# EAGLE design SCK_URBAN_BOARD_2.3 (EAGLE 9.6.2)
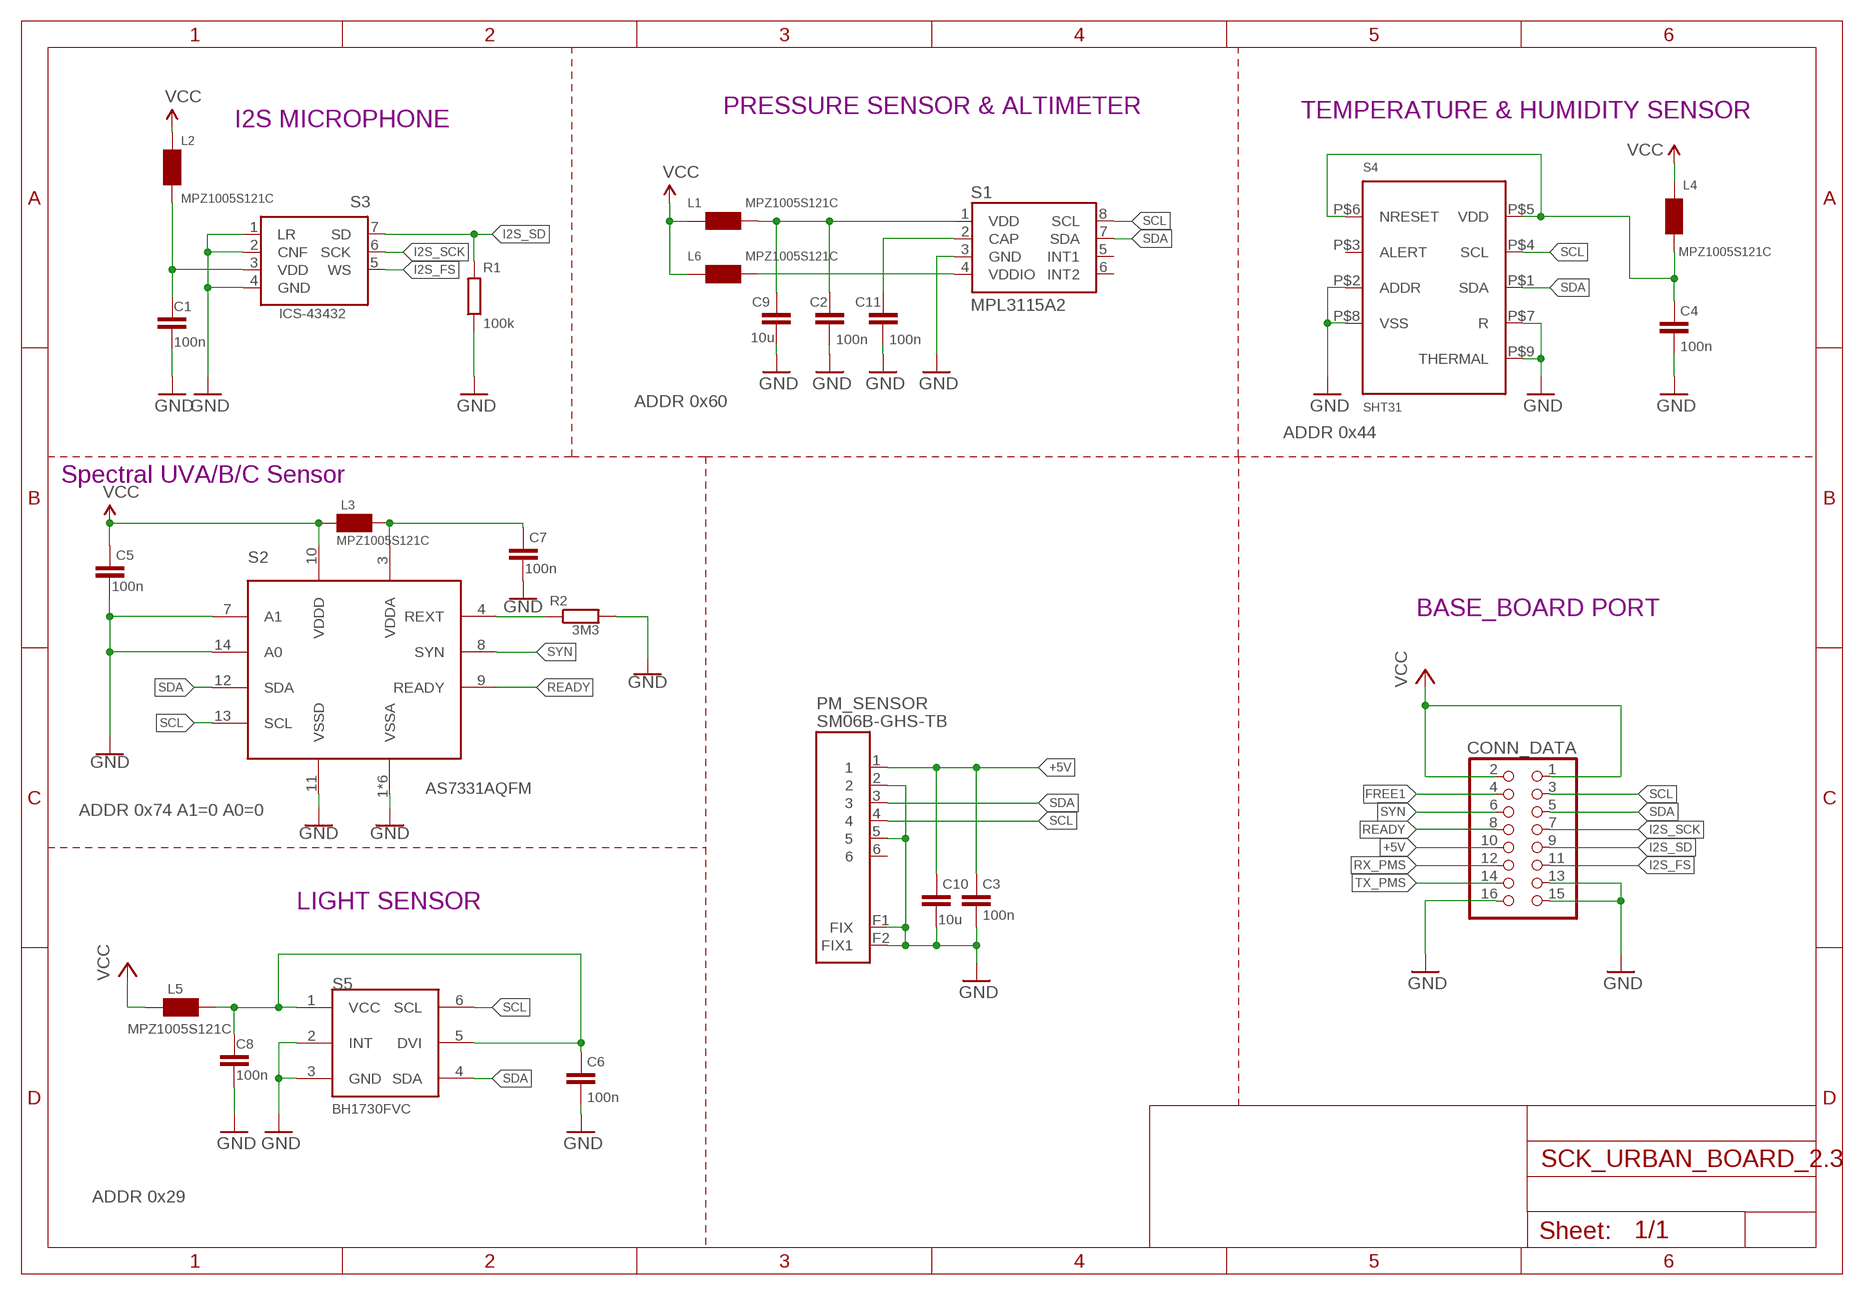
[diagram p0: schematic, sheet 1]

## Parts
C1  100n  C-EUC0402  [C0402]
C2  100n  C-EUC0402  [C0402]
C3  100n  C-EUC0402  [C0402]
C4  100n  C-EUC0402  [C0402]
C5  100n  C-EUC0402  [C0402]
C6  100n  C-EUC0402  [C0402]
C7  100n  C-EUC0402  [C0402]
C8  100n  C-EUC0402  [C0402]
C9  10u  C-EUC0603  [C0603]
C10  10u  C-EUC0603  [C0603]
C11  100n  C-EUC0402  [C0402]
CONN_DATA  PINHD_2X8MAL_SMD  [PINHD_2X8_SMD_MALE_UNHOLED]
L1  MPZ1005S121C  FERRITE-BEAD_0402  [L0402]
L2  MPZ1005S121C  FERRITE-BEAD_0402  [L0402]
L3  MPZ1005S121C  FERRITE-BEAD_0402  [L0402]
L4  MPZ1005S121C  FERRITE-BEAD_0402  [L0402]
L5  MPZ1005S121C  FERRITE-BEAD_0402  [L0402]
L6  MPZ1005S121C  FERRITE-BEAD_0402  [L0402]
PM_SENSOR  SM06B-GHS-TB  [SM06B-GHS-TB]
R1  100k  R-EU_R0402  [R0402]
R2  3M3  R-EU_R0402  [R0402]
S1  MPL3115A2  [MPL3115A2]
S2  AS7331AQFM  [OLGA16]
S3  ICS-43432  [ICS-43432]
S4  SHT31  SHT3X-DIS  [DFN8_STH3X-DIS]
S5  BH1730FVC  [WSOF6]

## Nets
+5V: C3.2 C10.2 CONN_DATA.10 PM_SENSOR.1
FREE1: CONN_DATA.4
GND: C1.1 C2.1 C3.1 C4.1 C5.1 C6.1 C7.1 C8.1 C9.1 C10.1 C11.1 CONN_DATA.13 CONN_DATA.15 CONN_DATA.16 PM_SENSOR.2 PM_SENSOR.5 PM_SENSOR.F1(FIX) PM_SENSOR.F2(FIX1) R1.1 R2.2 S1.3(GND) S2.1(VSSA) S2.2(VSSA) S2.5(VSSA) S2.6(VSSA) S2.7(A1) S2.11(VSSD) S2.14(A0) S2.15(VSSA) S2.16(VSSA) S3.1(LR) S3.2(CNF) S3.4(GND) S4.P$2(ADDR) S4.P$7(R) S4.P$8(VSS) S4.P$9(THERMAL) S5.2(INT) S5.3(GND)
I2S_FS: CONN_DATA.11 S3.5(WS)
I2S_SCK: CONN_DATA.7 S3.6(SCK)
I2S_SD: CONN_DATA.9 R1.2 S3.7(SD)
N$1: C7.2 L3.1 S2.3(VDDA)
N$2: R2.1 S2.4(REXT)
N$3: C6.2 C8.2 L5.2 S5.1(VCC) S5.5(DVI)
N$4: C11.2 S1.2(CAP)
N$5: C4.2 L4.2 S4.P$5(VDD) S4.P$6(NRESET)
N$8: L6.2 S1.4(VDDIO)
N$10: C2.2 C9.2 L1.2 S1.1(VDD)
N$17: C1.2 L2.2 S3.3(VDD)
READY: CONN_DATA.8 S2.9(READY)
RX_PMS: CONN_DATA.12
SCL: CONN_DATA.3 PM_SENSOR.4 S1.8(SCL) S2.13(SCL) S4.P$4(SCL) S5.6(SCL)
SDA: CONN_DATA.5 PM_SENSOR.3 S1.7(SDA) S2.12(SDA) S4.P$1(SDA) S5.4(SDA)
SYN: CONN_DATA.6 S2.8(SYN)
TX_PMS: CONN_DATA.14
VCC: C5.2 CONN_DATA.1 CONN_DATA.2 L1.1 L2.1 L3.2 L4.1 L5.1 L6.1 S2.10(VDDD)
Unconnected: PM_SENSOR.6 S1.5(INT1) S1.6(INT2) S4.P$3(ALERT)

## Notes on the sheet
- PRESSURE SENSOR & ALTIMETER | TEMPERATURE & HUMIDITY SENSOR
- I2S MICROPHONE
- ADDR 0x60
- ADDR 0x44
- Spectral UVA/B/C Sensor
- BASE_BOARD PORT
- ADDR 0x74 A1=0 A0=0
- LIGHT SENSOR
- ADDR 0x29

## Library data of the parts
C1-C11 = Hangar3D:C-EU: CAPACITOR, European symbol
CONN_DATA = Hangar3D:PINHD_2X8
L1-L6 = Hangar3D:FERRITE-BEAD: SMD EMI Suppression Ferrite Beads - excellent anti-EMI properties - low DCR - impedances till 3000 ohms - rated current up to 6 A
PM_SENSOR = Hangar3D:SM06B-GHS-TB
R1 R2 = Hangar3D:R-EU_: RESISTOR, European symbol
S1 = Hangar3D:MPL3115A2
S2 = Hangar3D:AS7331
S3 = Hangar3D:ICS-43432
S4 = Hangar3D:SHT3X-DIS
S5 = Hangar3D:BH1730FVC

## Net classes
1 power: width 1 mm, drill 0.6 mm, clearance 0.203 mm
2 gnd: width 0.254 mm, drill 0.254 mm, clearance 0.178 mm
3 usbvcc: width 0.254 mm, drill 0.6 mm, clearance 0.203 mm
4 aref: width 0.254 mm, drill 0.6 mm, clearance 0.203 mm

## Board
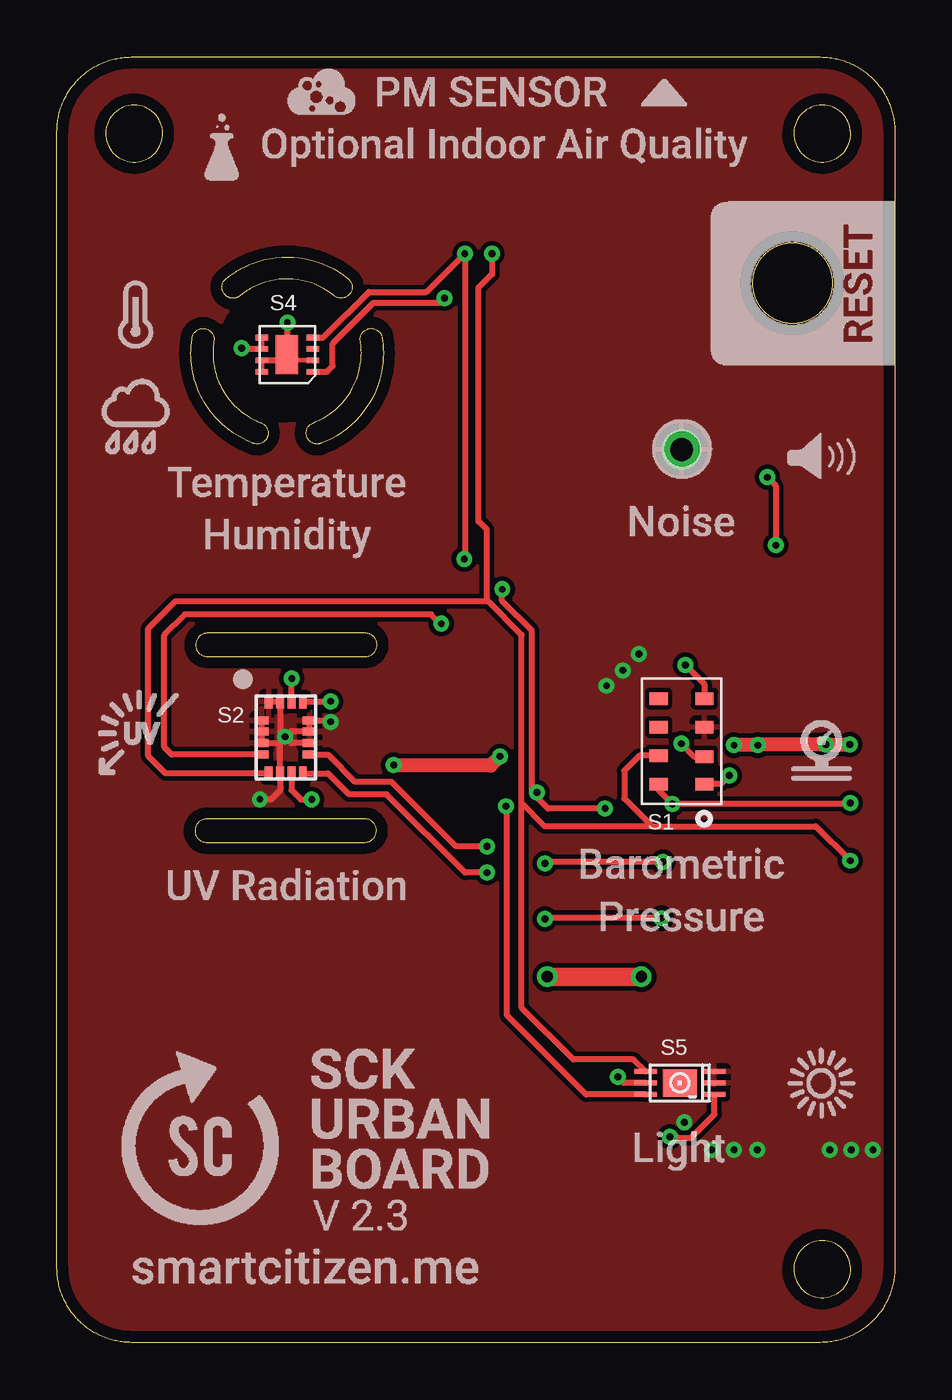
[diagram p1: board, top side]
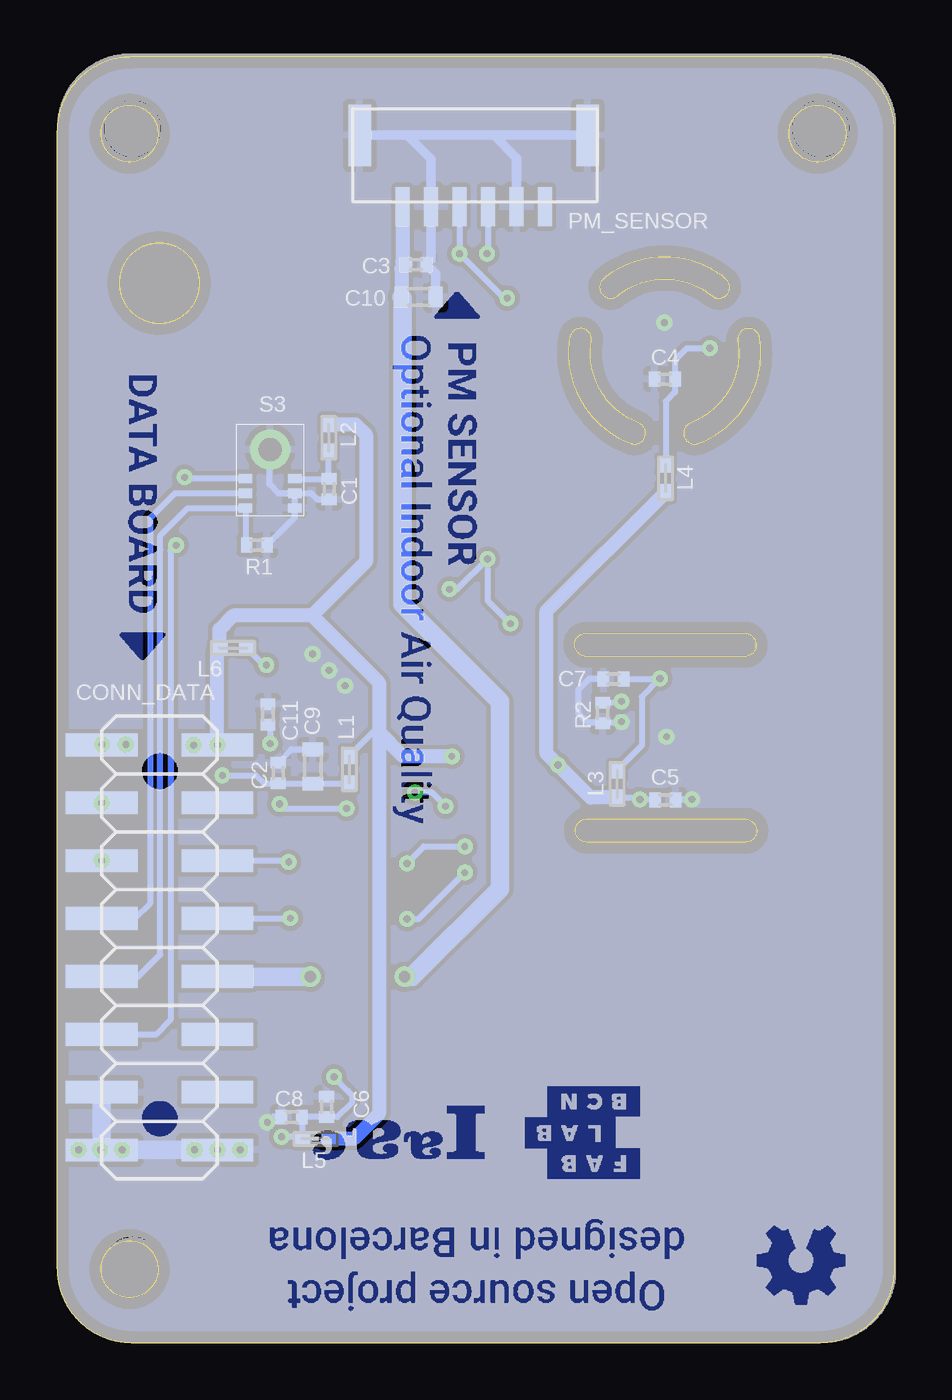
[diagram p2: board, bottom side, seen from below]

Size 36.78 x 56.42 mm. Coordinates in mm from the lower left corner, seen from the top.
Outline: 33.51,0 3.27,0 3.18,0 3.1,0 3.02,0.01 2.94,0.02 2.85,0.03 2.77,0.04 2.69,0.05 2.61,0.07 2.53,0.08 2.45,0.1 2.38,0.12 2.3,0.15 2.22,0.17 2.15,0.2 2.07,0.23 2,0.26 1.93,0.29 1.85,0.32 1.78,0.36 1.71,0.4 1.65,0.43 1.58,0.47 1.51,0.52 1.44,0.56 1.38,0.6 1.32,0.65 1.25,0.7 1.19,0.75 1.13,0.8 1.07,0.85 1.02,0.91 0.96,0.96 0.91,1.02 0.85,1.07 0.8,1.13 0.75,1.19 0.7,1.25 0.65,1.32 0.6,1.38 0.56,1.44 0.52,1.51 0.47,1.58 0.43,1.65 0.4,1.71 0.36,1.78 0.32,1.86 0.29,1.93 0.26,2 0.23,2.07 0.2,2.15 0.17,2.22 0.15,2.3 0.12,2.38 0.1,2.45 0.08,2.53 0.07,2.61 0.05,2.69 0.04,2.77 0.03,2.85 0.02,2.94 0.01,3.02 0,3.1 0,3.19 0,3.27 0,53.15 0,53.23 0,53.32 0.01,53.4 0.02,53.48 0.03,53.57 0.04,53.65 0.05,53.73 0.07,53.81 0.08,53.89 0.1,53.97 0.12,54.04 0.15,54.12 0.17,54.2 0.2,54.27 0.23,54.35 0.26,54.42 0.29,54.49 0.32,54.57 0.36,54.64 0.4,54.71 0.43,54.77 0.47,54.84 0.52,54.91 0.56,54.98 0.6,55.04 0.65,55.1 0.7,55.17 0.75,55.23 0.8,55.29 0.85,55.35 0.91,55.4 0.96,55.46 1.02,55.51 1.07,55.57 1.13,55.62 1.19,55.67 1.25,55.72 1.32,55.77 1.38,55.82 1.44,55.86 1.51,55.9 1.58,55.95 1.65,55.98 1.71,56.02 1.78,56.06 1.85,56.1 1.93,56.13 2,56.16 2.07,56.19 2.15,56.22 2.22,56.25 2.3,56.27 2.38,56.3 2.45,56.32 2.53,56.34 2.61,56.35 2.69,56.37 2.77,56.38 2.85,56.39 2.94,56.4 3.02,56.41 3.1,56.42 3.18,56.42 3.27,56.42 33.51,56.42 33.59,56.42 33.68,56.42 33.76,56.41 33.84,56.4 33.92,56.39 34.01,56.38 34.09,56.37 34.17,56.35 34.25,56.34 34.32,56.32 34.4,56.3 34.48,56.27 34.55,56.25 34.63,56.22 34.7,56.19 34.78,56.16 34.85,56.13 34.92,56.1 34.99,56.06 35.06,56.02 35.13,55.98 35.2,55.95 35.27,55.9 35.33,55.86 35.4,55.82 35.46,55.77 35.52,55.72 35.59,55.67 35.65,55.62 35.7,55.57 35.76,55.51 35.82,55.46 35.87,55.4 35.93,55.35 35.98,55.29 36.03,55.23 36.08,55.17 36.13,55.1 36.17,55.04 36.22,54.98 36.26,54.91 36.3,54.84 36.34,54.77 36.38,54.71 36.42,54.64 36.45,54.57 36.49,54.49 36.52,54.42 36.55,54.35 36.58,54.27 36.61,54.2 36.63,54.12 36.65,54.04 36.67,53.97 36.69,53.89 36.71,53.81 36.73,53.73 36.74,53.65 36.75,53.57 36.76,53.48 36.77,53.4 36.77,53.32 36.78,53.23 36.78,53.15 36.78,3.27 36.78,3.19 36.77,3.1 36.77,3.02 36.76,2.94 36.75,2.85 36.74,2.77 36.73,2.69 36.71,2.61 36.69,2.53 36.67,2.45 36.65,2.38 36.63,2.3 36.61,2.22 36.58,2.15 36.55,2.07 36.52,2 36.49,1.93 36.45,1.86 36.42,1.78 36.38,1.71 36.34,1.65 36.3,1.58 36.26,1.51 36.22,1.44 36.17,1.38 36.13,1.32 36.08,1.25 36.03,1.19 35.98,1.13 35.93,1.07 35.87,1.02 35.82,0.96 35.76,0.91 35.7,0.85 35.65,0.8 35.59,0.75 35.52,0.7 35.46,0.65 35.4,0.6 35.33,0.56 35.27,0.52 35.2,0.47 35.13,0.43 35.06,0.4 34.99,0.36 34.92,0.32 34.85,0.29 34.78,0.26 34.7,0.23 34.63,0.2 34.55,0.17 34.48,0.15 34.4,0.12 34.32,0.1 34.25,0.08 34.17,0.07 34.09,0.05 34.01,0.04 33.92,0.03 33.84,0.02 33.76,0.01 33.68,0 33.59,0 33.51,0
Outline: 11.42,39.43 11.39,39.43 11.36,39.44 11.32,39.44 11.29,39.45 11.26,39.46 11.23,39.47 11.2,39.49 11.17,39.51 11.14,39.52 11.12,39.54 11.09,39.57 11.07,39.59 11.04,39.62 11.02,39.64 11.01,39.67 10.99,39.71 10.98,39.74 10.96,39.78 10.95,39.82 10.94,39.87 10.94,39.91 10.94,39.95 10.95,40 10.96,40.04 10.97,40.08 10.99,40.12 11.01,40.16 11.03,40.2 11.06,40.23 11.09,40.26 11.12,40.29 11.15,40.32 11.19,40.34 11.23,40.36 11.36,40.41 11.55,40.5 11.73,40.6 11.91,40.7 12.07,40.82 12.23,40.95 12.38,41.09 12.52,41.23 12.65,41.39 12.77,41.55 12.88,41.72 12.98,41.9 13.07,42.08 13.15,42.27 13.22,42.46 13.27,42.66 13.31,42.87 13.34,43.02 13.34,43.08 13.35,43.13 13.35,43.19 13.36,43.24 13.36,43.3 13.36,43.35 13.36,43.41 13.36,43.46 13.36,43.52 13.36,43.57 13.35,43.63 13.35,43.68 13.35,43.74 13.34,43.79 13.33,43.84 13.33,43.9 13.32,43.95 13.31,44 13.31,44.04 13.32,44.09 13.32,44.13 13.33,44.17 13.35,44.21 13.37,44.25 13.39,44.29 13.42,44.33 13.44,44.36 13.47,44.39 13.51,44.41 13.54,44.44 13.58,44.46 13.62,44.48 13.67,44.49 13.71,44.5 13.76,44.51 13.8,44.51 13.84,44.51 13.89,44.5 13.93,44.49 13.97,44.48 14.01,44.46 14.05,44.44 14.08,44.41 14.12,44.39 14.15,44.36 14.18,44.32 14.2,44.29 14.22,44.25 14.24,44.21 14.26,44.16 14.27,44.12 14.28,44.06 14.29,43.99 14.3,43.92 14.31,43.85 14.31,43.77 14.32,43.7 14.32,43.63 14.32,43.56 14.33,43.49 14.33,43.42 14.33,43.35 14.32,43.28 14.32,43.21 14.32,43.14 14.31,43.06 14.31,42.99 14.3,42.92 14.28,42.76 14.23,42.5 14.16,42.24 14.08,41.98 13.98,41.74 13.87,41.5 13.74,41.27 13.6,41.05 13.45,40.83 13.28,40.63 13.1,40.44 12.91,40.26 12.71,40.09 12.49,39.93 12.27,39.79 12.03,39.66 11.79,39.54 11.59,39.46 11.58,39.46 11.57,39.46 11.56,39.45 11.55,39.45 11.54,39.45 11.53,39.45 11.52,39.44 11.51,39.44 11.5,39.44 11.49,39.44 11.48,39.44 11.47,39.44 11.46,39.43 11.45,39.43 11.44,39.43 11.43,39.43 11.42,39.43
Outline: 8.79,39.43 8.74,39.43 8.69,39.44 8.64,39.45 8.62,39.46 8.61,39.47 8.59,39.47 8.55,39.49 8.47,39.52 8.32,39.59 8.16,39.67 8.01,39.75 7.86,39.84 7.72,39.93 7.58,40.03 7.56,40.05 7.55,40.05 7.55,40.06 7.53,40.07 7.4,40.17 7.28,40.28 7.16,40.39 7.05,40.5 6.94,40.62 6.83,40.75 6.73,40.87 6.64,41 6.55,41.13 6.47,41.27 6.39,41.41 6.32,41.55 6.25,41.69 6.19,41.84 6.13,41.99 6.08,42.14 6.03,42.29 5.99,42.44 5.96,42.6 5.93,42.76 5.91,42.91 5.89,43.07 5.88,43.23 5.88,43.4 5.88,43.56 5.89,43.72 5.9,43.88 5.92,44.05 5.93,44.09 5.93,44.1 5.93,44.1 5.93,44.1 5.93,44.11 5.94,44.12 5.95,44.17 5.97,44.22 6,44.27 6.03,44.31 6.06,44.35 6.1,44.39 6.14,44.42 6.19,44.45 6.23,44.47 6.28,44.49 6.33,44.5 6.39,44.51 6.44,44.51 6.49,44.5 6.55,44.49 6.6,44.47 6.65,44.45 6.69,44.42 6.73,44.38 6.77,44.35 6.8,44.31 6.83,44.26 6.85,44.22 6.87,44.17 6.88,44.12 6.89,44.06 6.89,44.01 6.89,43.95 6.89,43.95 6.89,43.95 6.89,43.94 6.88,43.91 6.87,43.85 6.86,43.72 6.85,43.6 6.84,43.47 6.85,43.35 6.85,43.22 6.86,43.1 6.88,42.98 6.89,42.85 6.92,42.73 6.95,42.61 6.98,42.5 7.02,42.38 7.06,42.26 7.1,42.15 7.15,42.04 7.21,41.93 7.26,41.82 7.33,41.71 7.39,41.61 7.46,41.51 7.54,41.41 7.62,41.31 7.7,41.22 7.79,41.13 7.88,41.04 7.97,40.96 8.07,40.88 8.12,40.84 8.13,40.83 8.13,40.82 8.13,40.82 8.14,40.82 8.17,40.8 8.28,40.72 8.39,40.65 8.5,40.58 8.62,40.52 8.74,40.46 8.86,40.41 8.92,40.38 8.95,40.37 8.98,40.36 9.03,40.33 9.07,40.3 9.11,40.27 9.15,40.23 9.18,40.19 9.21,40.15 9.23,40.1 9.25,40.05 9.26,40 9.27,39.95 9.27,39.89 9.26,39.84 9.25,39.79 9.24,39.76 9.24,39.74 9.22,39.7 9.2,39.66 9.17,39.63 9.15,39.59 9.12,39.56 9.09,39.54 9.05,39.51 9.02,39.49 8.98,39.47 8.95,39.46 8.91,39.45 8.87,39.44 8.83,39.43 8.79,39.43
Outline: 7.73,45.83 7.71,45.83 7.68,45.83 7.66,45.84 7.63,45.84 7.61,45.84 7.59,45.85 7.56,45.86 7.54,45.87 7.52,45.88 7.5,45.89 7.47,45.9 7.45,45.92 7.43,45.93 7.41,45.95 7.39,45.96 7.38,45.98 7.36,46 7.33,46.04 7.31,46.07 7.29,46.11 7.27,46.15 7.26,46.2 7.25,46.24 7.25,46.28 7.25,46.32 7.25,46.37 7.26,46.41 7.27,46.45 7.28,46.49 7.3,46.53 7.32,46.57 7.35,46.61 7.38,46.64 7.41,46.67 7.45,46.71 7.51,46.76 7.56,46.8 7.62,46.84 7.68,46.88 7.74,46.92 7.8,46.96 7.86,47 7.92,47.04 7.98,47.07 8.04,47.11 8.1,47.14 8.17,47.17 8.23,47.21 8.3,47.24 8.36,47.27 8.43,47.3 8.56,47.35 8.81,47.44 9.07,47.51 9.33,47.57 9.59,47.61 9.85,47.64 10.12,47.64 10.38,47.64 10.64,47.61 10.9,47.57 11.15,47.51 11.41,47.44 11.66,47.35 11.9,47.24 12.13,47.12 12.37,46.99 12.59,46.84 12.78,46.69 12.82,46.66 12.85,46.62 12.87,46.59 12.9,46.55 12.92,46.51 12.93,46.47 12.94,46.43 12.95,46.39 12.96,46.34 12.96,46.3 12.95,46.26 12.95,46.21 12.94,46.17 12.92,46.13 12.9,46.09 12.88,46.05 12.85,46.01 12.82,45.98 12.79,45.95 12.75,45.92 12.72,45.9 12.68,45.88 12.64,45.86 12.6,45.85 12.55,45.84 12.51,45.83 12.47,45.83 12.42,45.84 12.38,45.84 12.34,45.85 12.3,45.87 12.26,45.88 12.22,45.91 12.18,45.93 12.06,46.03 11.89,46.15 11.71,46.25 11.53,46.35 11.34,46.43 11.15,46.51 10.96,46.56 10.76,46.61 10.56,46.65 10.36,46.67 10.16,46.68 9.96,46.68 9.75,46.66 9.55,46.63 9.35,46.59 9.15,46.54 8.95,46.47 8.82,46.41 8.77,46.39 8.72,46.37 8.67,46.34 8.62,46.32 8.57,46.3 8.52,46.27 8.48,46.24 8.43,46.21 8.38,46.19 8.34,46.16 8.29,46.13 8.24,46.1 8.2,46.06 8.16,46.03 8.11,46 8.07,45.97 8.03,45.94 8.02,45.92 8,45.91 7.98,45.9 7.97,45.89 7.95,45.88 7.93,45.87 7.92,45.87 7.9,45.86 7.88,45.85 7.86,45.85 7.84,45.84 7.82,45.84 7.8,45.84 7.79,45.83 7.77,45.83 7.75,45.83 7.73,45.83
Outline: 3.39,54.3 3.26,54.3 3.14,54.28 3.02,54.25 2.91,54.21 2.8,54.16 2.7,54.1 2.6,54.03 2.52,53.95 2.44,53.86 2.36,53.77 2.3,53.67 2.25,53.56 2.2,53.45 2.17,53.33 2.15,53.21 2.14,53.09 2.14,52.96 2.16,52.84 2.19,52.72 2.22,52.6 2.27,52.49 2.33,52.39 2.4,52.29 2.48,52.2 2.56,52.12 2.65,52.05 2.75,51.98 2.86,51.93 2.97,51.88 3.08,51.84 3.2,51.82 3.33,51.81 3.45,51.81 3.58,51.82 3.7,51.84 3.81,51.88 3.92,51.93 4.03,51.98 4.13,52.05 4.22,52.12 4.3,52.2 4.38,52.29 4.45,52.39 4.51,52.49 4.56,52.6 4.59,52.72 4.62,52.84 4.64,52.96 4.64,53.09 4.63,53.21 4.61,53.33 4.58,53.45 4.53,53.56 4.48,53.67 4.42,53.77 4.34,53.86 4.26,53.95 4.17,54.03 4.08,54.1 3.98,54.16 3.87,54.21 3.76,54.25 3.64,54.28 3.52,54.3 3.39,54.3
Outline: 33.59,54.3 33.47,54.3 33.34,54.28 33.23,54.25 33.11,54.21 33,54.16 32.9,54.1 32.81,54.03 32.72,53.95 32.64,53.86 32.57,53.77 32.5,53.67 32.45,53.56 32.41,53.45 32.37,53.33 32.35,53.21 32.34,53.09 32.34,52.96 32.36,52.84 32.39,52.72 32.43,52.6 32.47,52.49 32.53,52.39 32.6,52.29 32.68,52.2 32.76,52.12 32.85,52.05 32.95,51.98 33.06,51.93 33.17,51.88 33.28,51.84 33.4,51.82 33.53,51.81 33.65,51.81 33.78,51.82 33.9,51.84 34.01,51.88 34.12,51.93 34.23,51.98 34.33,52.05 34.42,52.12 34.51,52.2 34.58,52.29 34.65,52.39 34.71,52.49 34.76,52.6 34.8,52.72 34.82,52.84 34.84,52.96 34.84,53.09 34.83,53.21 34.81,53.33 34.78,53.45 34.73,53.56 34.68,53.67 34.62,53.77 34.55,53.86 34.46,53.95 34.38,54.03 34.28,54.1 34.18,54.16 34.07,54.21 33.96,54.25 33.84,54.28 33.72,54.3 33.59,54.3
Outline: 33.59,4.47 33.47,4.46 33.34,4.45 33.23,4.42 33.11,4.38 33,4.32 32.9,4.26 32.81,4.19 32.72,4.11 32.64,4.03 32.57,3.93 32.5,3.83 32.45,3.73 32.41,3.62 32.37,3.5 32.35,3.38 32.34,3.25 32.34,3.13 32.36,3 32.39,2.88 32.43,2.77 32.47,2.66 32.53,2.56 32.6,2.46 32.68,2.37 32.76,2.29 32.85,2.21 32.95,2.15 33.06,2.09 33.17,2.04 33.28,2.01 33.4,1.98 33.53,1.97 33.65,1.97 33.78,1.98 33.9,2.01 34.01,2.04 34.12,2.09 34.23,2.15 34.33,2.21 34.42,2.29 34.51,2.37 34.58,2.46 34.65,2.56 34.71,2.66 34.76,2.77 34.8,2.88 34.82,3 34.84,3.13 34.84,3.25 34.83,3.38 34.81,3.5 34.78,3.62 34.73,3.73 34.68,3.83 34.62,3.93 34.55,4.03 34.46,4.11 34.38,4.19 34.28,4.26 34.18,4.32 34.07,4.38 33.96,4.42 33.84,4.45 33.72,4.46 33.59,4.47
Outline: 6.6,31.13 arc90 6.09,30.62 6.09,30.59 arc90 6.57,30.11 13.51,30.11 arc90 14.05,30.59 arc90 13.57,31.13 6.6,31.13
Outline: 6.57,22.97 arc90 6.06,22.47 6.06,22.44 arc90 6.54,21.96 13.49,21.96 arc90 14.02,22.44 arc90 13.54,22.97 6.57,22.97
Outline: circle at 32.28,46.49 radius 1.75
Copper layers (1*16): Top 0.035mm / dielectric 1.5mm / Bottom 0.035mm
Design rules "default *": minimum track width 0.2mm, minimum drill 0.3mm, track to track 0.2mm, track to pad 0.2mm, pad to pad 0.2mm, via to via 0.2mm, smd to smd 0.2mm, copper to edge 20mil, drill to drill 0.6mm, minimum pad ring 10mil, minimum via ring 0.2mm, stop-mask expansion 2mil, vias tented up to drill 24mil, thermal gap 10mil
tRestrict: area 7.1,40.5 to 13.1,46.5

### Footprints (pad centres in the part's own frame; a part is rotated, then mirrored left to right if it is on the bottom)
C0402 = smd 0.5 x 0.65: 1 -0.45,0; 2 0.45,0
C0603 = smd 0.6 x 0.9: 1 -0.8,0; 2 0.7,0
PINHD_2X8_SMD_MALE_UNHOLED = smd 1 x 3.15: 1 -8.89,-2.54; 2 -8.89,2.54; 3 -6.35,-2.54; 4 -6.35,2.54; 5 -3.81,-2.54; 6 -3.81,2.54; 7 -1.27,-2.54; 8 -1.27,2.54; 9 1.27,-2.54; 10 1.27,2.54; 11 3.81,-2.54; 12 3.81,2.54; 13 6.35,-2.54; 14 6.35,2.54; 15 8.89,-2.54; 16 8.89,2.54
L0402 = smd 0.7 x 0.6: 1 -0.6,0; 2 0.6,0
SM06B-GHS-TB = smd 0.6 x 1.7: 1 -3.125,0; 2 -1.875,0; 3 -0.625,0; 4 0.625,0; 5 1.875,0; 6 3.125,0 | smd 1 x 2.7: F1 -5,3.125; F2 5,3.125
R0402 = smd 0.5 x 0.65: 1 -0.45,0; 2 0.45,0
MPL3115A2 = smd 0.55 x 0.8: 1 -1.875,-1; 2 -0.675,-1; 3 0.625,-1; 4 1.875,-1; 5 1.875,1; 6 0.625,1; 7 -0.625,1; 8 -1.875,1
OLGA16 = smd 0.35 x 0.6: 1 -0.75,1.575; 2 -0.25,1.575; 3 0.25,1.575; 4 0.75,1.575; 9 0.75,-1.575; 10 0.25,-1.575; 11 -0.25,-1.575; 12 -0.75,-1.575 | smd 0.6 x 0.35: 5 1.05,0.75; 6 1.05,0.25; 7 1.05,-0.25; 8 1.05,-0.75; 13 -1.05,-0.75; 14 -1.05,-0.25; 15 -1.05,0.25; 16 -1.05,0.75
ICS-43432 = smd 0.4 x 0.6: 1 2.572,1.079; 2 1.924,1.079; 3 1.276,1.079; 5 1.276,-1.079; 6 1.924,-1.079; 7 2.572,-1.079 | drill 1 pad 1.75: 4 0,0
DFN8_STH3X-DIS = smd 0.55 x 0.25: P$1 -1.149,0.737; P$2 -1.149,0.237; P$3 -1.149,-0.263; P$4 -1.149,-0.763; P$5 1.101,-0.763; P$6 1.101,-0.263; P$7 1.101,0.237; P$8 1.101,0.737 | smd 1 x 1.7: P$9 0.001,-0.013
WSOF6 = smd 0.22 x 1: 1 -0.5,-1.5; 2 0,-1.5; 3 0.5,-1.5; 4 0.5,1.5; 5 0,1.5; 6 -0.5,1.5 | smd 1.2 x 1.5: P$1 0,0

### Placement (x,y rotation side)
C1  24.84,37.45 90 bottom
C2  27.08,24.99 270 bottom
C3  21.02,47.31 180 bottom
C4  10.1,42.28 0 bottom
C5  10.08,23.81 180 bottom
C6  24.95,10.35 270 bottom
C7  12.35,29.13 0 bottom
C8  26.48,9.9 0 bottom
C9  25.55,25.23 270 bottom
C10  20.96,45.89 180 bottom
C11  27.52,27.57 270 bottom
CONN_DATA  32.28,17.34 270 bottom
L1  23.95,25.15 270 bottom
L2  24.86,39.71 270 bottom
L3  12.19,24.51 270 bottom
L4  10.06,37.93 90 bottom
L5  25.42,8.94 180 bottom
L6  29.04,30.48 0 bottom
PM_SENSOR  18.49,49.85 0 bottom
R1  28,35 180 bottom
R2  12.82,27.63 270 bottom
S1  27.42,26.38 90 top
S2  10.04,26.56 0 top
S3  27.42,39.19 270 bottom
S4  10.09,43.34 180 top
S5  27.34,11.39 90 top

### Tracks (layer width: path | path; a pad name or v marks a point on that pad's centre or on a via)
+5V  (via drill 0.5 pad 0.7)
  Top 0.813: v21.52,16.05 v25.65,16.05
  Bottom 0.254: 21.12,16.13 21.2,16.05 | 29.72,16.05 CONN_DATA.10
  Bottom 0.61: PM_SENSOR.1 21.61,47.45 C3.2 21.66,47.12 C10.2
  Bottom 0.813: 21.12,16.13 17.33,19.91 17.33,28.14 21.6,32.41 21.6,45.83 C10.2 | 21.2,16.05 v21.52,16.05 | v25.65,16.05 29.72,16.05
GND  (via drill 0.3, 0.3 pad 0.7)
  Top 0.2: S4.P$2 10.34,43.11 S4.P$9
  Top 0.254: S4.P$9 10.09,43.22 9.98,43.11 S4.P$7 S4.P$8 | S4.P$9 10.34,43.11 | v10.12,44.77 10.09,44.74 S4.P$9 | 10.12,26.59 v10.02,26.59 | S2.7 10.29,26.31 v10.02,26.59 | v10.02,26.59 10.24,26.81 S2.6 S2.5 11.94,27.31 v12.01,27.24 | S2.16 S2.15 | S2.15 S2.14 9.74,26.31 v10.02,26.59 | v10.02,26.59 9.79,26.36 S2.11 9.79,24.23 9.41,23.84 v8.91,23.84 | S2.1 S2.2 9.79,26.81 v10.02,26.59 | S2.14 S2.15
  Bottom 0.254: S3.2 25.61,37.27 25.34,37 C1.1 | S3.2 S3.1 26.34,36.21 R1.1 | S3.2 26.36,37.29 | C8.1 27.31,9.89 v27.54,9.66 | v8.91,23.84 9.6,23.84 C5.1 | C7.1 13.42,29.12 13.91,28.64 13.91,27.64 13.51,27.24 12.88,27.24 R2.2 12.77,27.24 v12.01,27.24 | S3.2 27.05,37.27 27.45,37.67 27.45,39.16 S3.4 | C2.1 26.49,26.03 C9.1
  Bottom 0.406: PM_SENSOR.F2 17.6,52.98 | 17.6,52.98 21.4,52.98 | 21.4,52.98 PM_SENSOR.F1 | 21.4,52.98 20.36,51.94 PM_SENSOR.2 20.36,47.52 C3.1 20.16,46.9 C10.1 | PM_SENSOR.5 16.61,51.99 17.6,52.98
  Bottom 0.813: CONN_DATA.13 CONN_DATA.15 CONN_DATA.16
  other vias: 28.74,8.46 29.72,8.46 30.74,8.46 33.92,8.46 34.87,8.46 35.82,8.46 24.13,28.82 24.84,29.5 25.55,30.21
  pour Bottom (rank 2): 37.28,57.44 -0.72,57.79 -0.45,-0.89 37.33,-1.06
  pour Top (rank 2): 37.28,57.44 -0.72,57.54 -0.82,-0.91 37.28,-0.86
I2S_FS  (via drill 0.3 pad 0.7)
  Top 0.254: v31.18,37.97 31.55,37.6 v31.55,34.99
  Bottom 0.254: CONN_DATA.11 32.41,13.53 31.79,14.15 31.79,34.75 v31.55,34.99 | S3.5 31.12,37.92 v31.18,37.97
I2S_SCK
  Bottom 0.254: CONN_DATA.7 33.36,18.61 32.7,19.27 32.7,36.18 31.61,37.27 S3.6
I2S_SD
  Bottom 0.254: R1.2 28.5,35.05 S3.7 31.04,36.62 32.24,35.42 32.24,34.8 32.24,17.03 33.21,16.07 CONN_DATA.9
N$1  (via drill 0.3)
  Top 0.254: S2.3 v10.29,29.13 v10.31,29.14
  Bottom 0.254: C7.2 10.32,29.12 v10.31,29.14 11.11,28.34 11.11,26.2 L3.1
N$2  (via drill 0.3)
  Top 0.254: S2.4 v12.01,28.14
  Bottom 0.254: R2.1 12.06,28.08 v12.01,28.14
N$3  (via drill 0.3 pad 0.7)
  Top 0.254: S5.5 24.89,11.39 v24.62,11.66 | S5.1 28.86,10.87 28.86,10.02 27.82,8.98 27.26,8.98 27.23,9.02 v26.91,9.02
  Bottom 0.254: v24.62,11.66 24.01,11.05 23.82,10.86 23.82,10.55 24.47,9.9 C6.2 C8.2 L5.2 26.1,9.02 v26.91,9.02
N$4  (via drill 0.3 pad 0.7)
  Top 0.254: v27.42,26.28 27.99,25.71 S1.2
  Bottom 0.254: C11.2 27.42,27.02 v27.42,26.28
N$5  (via drill 0.3 pad 0.7)
  Top 0.254: S4.P$5 S4.P$6 8.14,43.61 v8.11,43.64
  Bottom 0.254: v8.11,43.64 9.13,43.64 9.65,43.12 C4.2 9.65,41.7 10.06,41.3 L4.2
N$8  (via drill 0.3 pad 0.7)
  Top 0.254: v27.58,29.74 28.42,28.91 S1.4
  Bottom 0.254: L6.2 27.7,29.74 v27.58,29.74
N$10  (via drill 0.3 pad 0.7)
  Top 0.254: v29.52,24.89 29.13,24.51 S1.1
  Bottom 0.254: v29.52,24.89 28.06,24.89 27.69,24.53 27.09,24.53 C2.2 25.56,24.54 C9.2 23.97,24.53 L1.2
N$17
  Bottom 0.254: S3.3 26.32,37.9 C1.2 24.86,37.92 L2.2
READY  (via drill 0.3 pad 0.7)
  Top 0.254: S2.9 11.89,24.98 12.81,24.06 14.47,24.06 17.91,20.62 v18.88,20.62 | v26.54,18.62 21.45,18.62 v21.42,18.59
  Bottom 0.254: CONN_DATA.8 26.55,18.61 v26.54,18.62 | v21.42,18.59 20.91,18.59 v18.88,20.62
SCL  (via drill 0.3, 0.3 pad 0.7)
  Top 0.254: S2.13 5.04,25.81 4.71,26.14 4.71,31.04 5.62,31.96 16.42,31.96 16.83,31.55 v16.87,31.55 | v17.88,34.39 17.9,34.41 v17.9,47.79 16.22,46.11 13.69,46.11 11.69,44.11 S4.P$4 | S1.8 26.42,24.23 v27.01,23.64 34.77,23.64 CONN_DATA.3 | v24.06,23.44 21.55,23.44 20.85,24.14 20.85,24.36 | 20.85,24.36 20.85,31.25 19.54,32.55 v19.54,33.06 | S5.6 23.22,10.89 19.76,14.36 19.76,23.5 v19.72,23.54 | v21.07,24.14 20.85,24.36
  Bottom 0.254: v17.9,47.79 17.86,47.83 PM_SENSOR.4 | v16.87,31.55 17.88,32.56 v17.88,34.39 19.21,33.06 v19.54,33.06 | v27.01,23.64 26.81,23.44 v24.06,23.44 | v19.72,23.54 20.32,24.14 v21.07,24.14
  other vias: 34.82,23.69
SDA  (via drill 0.3, 0.3 pad 0.7)
  Top 0.254: S2.12 4.77,24.98 4.01,25.74 4.01,31.34 5.21,32.54 18.87,32.54 | v19.1,47.79 19.1,46.89 18.5,46.29 18.5,36.04 18.87,35.68 18.87,32.54 | 20.39,23.67 20.39,14.69 22.66,12.42 25.31,12.42 S5.4 | 20.39,23.67 20.39,31.06 18.89,32.56 18.87,32.54 | S4.P$1 11.85,42.61 12.1,42.85 12.1,43.84 13.9,45.63 16.81,45.63 v17.01,45.84 | v17.01,45.84 | S1.7 25.57,25.76 24.91,25.1 24.91,23.88 26.13,22.66 | CONN_DATA.5 33.31,22.66 26.13,22.66 | 26.13,22.66 21.41,22.66 20.39,23.67
  Bottom 0.254: PM_SENSOR.3 v19.11,47.8 v19.1,47.79 17.15,45.84 v17.01,45.84
  other vias: 34.82,21.15
SYN  (via drill 0.3 pad 0.7)
  Top 0.254: S2.8 11.89,25.81 13.09,24.61 14.69,24.61 17.52,21.78 v18.88,21.78 | v26.6,21.1 21.49,21.1 v21.42,21.03
  Bottom 0.254: CONN_DATA.6 26.65,21.15 v26.6,21.1 | v21.42,21.03 20.67,21.78 v18.88,21.78
VCC  (via drill 0.3, 0.3 pad 0.7)
  Top 0.254: S2.10 10.29,24.24 10.71,23.83 v11.19,23.83
  Top 0.61: v19.45,25.73 19.03,25.32 14.81,25.32 v14.78,25.34 | v29.72,26.21 v30.77,26.21 30.8,26.25 v33.75,26.25 v34.8,26.25 | v29.72,26.21
  Bottom 0.254: C5.2 10.55,23.83 v11.19,23.83 11.27,23.91 L3.2 | L1.1 22.91,26.79 22.65,26.79
  Bottom 0.61: L5.1 23.75,8.94 22.65,10.04 22.65,26.79 | 25.58,31.9 22.65,28.96 22.65,26.79 | 25.58,31.9 29.04,31.9 29.64,31.3 L6.1 | 29.7,26.19 29.69,26.23 | 29.69,26.23 29.67,26.29 | L3.2 13.35,23.91 v14.78,25.34 15.29,25.85 15.29,32.11 L4.1 | v19.45,25.73 21.58,25.73 22.65,26.79 | L6.1 29.67,30.46 | CONN_DATA.2 29.74,30.39 L6.1 | L2.1 23.68,40.31 23.21,39.84 23.21,34.27 25.58,31.9 | CONN_DATA.1 v34.8,26.25 | CONN_DATA.2 v29.72,26.21 | CONN_DATA.2 29.69,26.23

### Text on the board
_bNames: S3